# EAGLE design modular pcb1 (EAGLE 9.6.2)
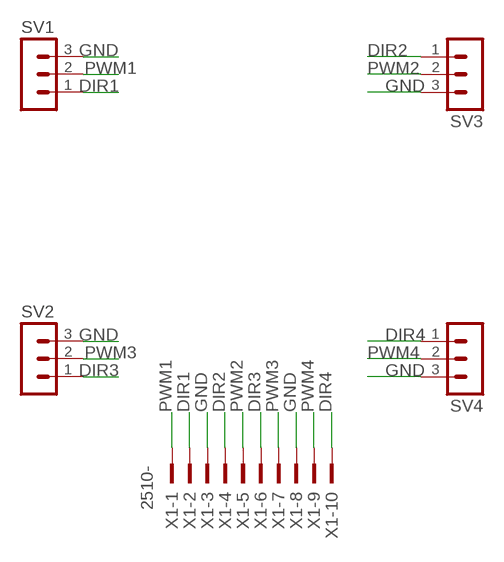
[diagram p0: schematic, sheet 1]

## Parts
SV1  MA03-1  [MA03-1]
SV2  MA03-1  [MA03-1]
SV3  MA03-1  [MA03-1]
SV4  MA03-1  [MA03-1]
X1  2510-  [PAK100/2500-10]

## Nets
DIR1: SV1.1 X1.2
DIR2: SV3.1 X1.4
DIR3: SV2.1 X1.6
DIR4: SV4.1 X1.10
GND: SV1.3 SV2.3 SV3.3 SV4.3 X1.3 X1.8
PWM1: SV1.2 X1.1
PWM2: SV3.2 X1.5
PWM3: SV2.2 X1.7
PWM4: SV4.2 X1.9

## Library data of the parts
SV1-SV4 = con-lstb:MA03-1: PIN HEADER; OC_FARNELL: unknown; OC_NEWARK: unknown
X1 = con-3m:2510-: 3M (TM) Pak 100 4-Wall Header Source: 3M; MF: 3M; MPN: 2510-6002UB; OC_FARNELL: 9838244; OC_NEWARK: 46F4725

## Board
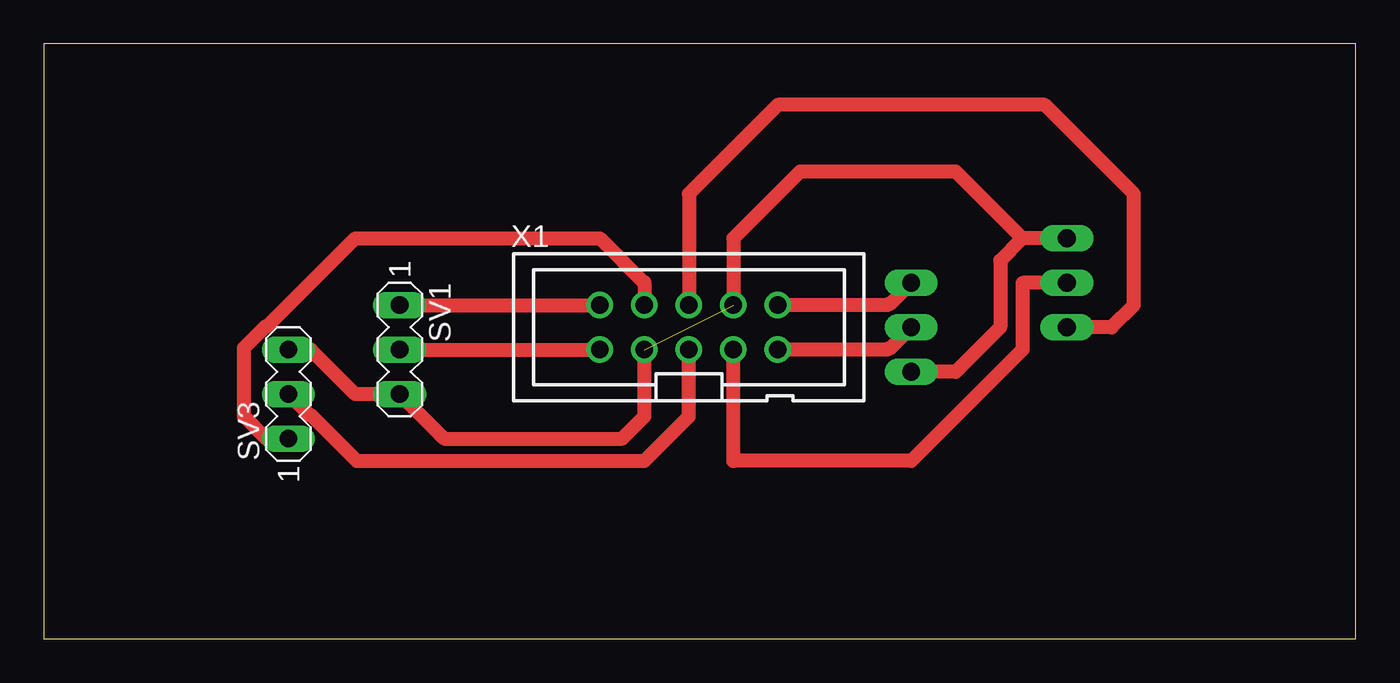
[diagram p1: board, top side]
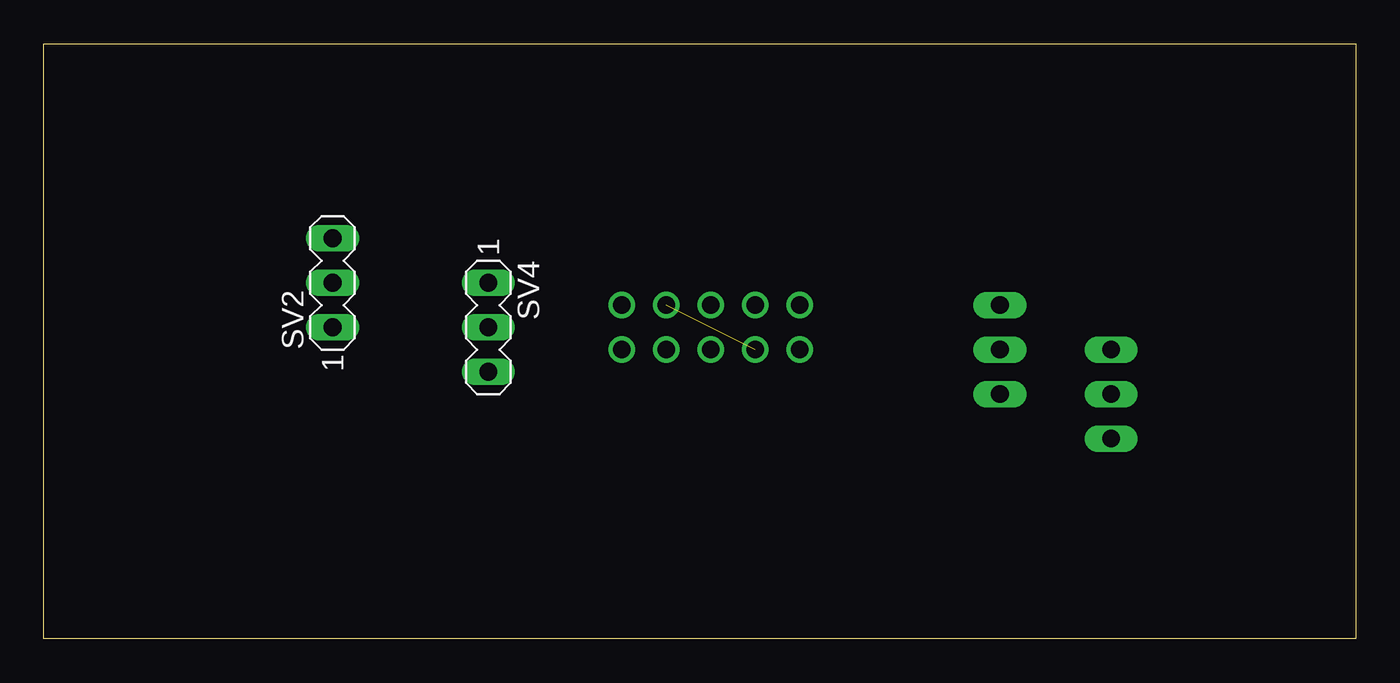
[diagram p2: board, bottom side, seen from below]

Size 74.91 x 33.96 mm. Coordinates in mm from the lower left corner, seen from the top.
Outline: 0,0 74.91,0 74.91,33.96 0,33.96 0,0
Copper layers (1*16): Top 0.035mm / dielectric 1.5mm / Bottom 0.035mm
Design rules "default": minimum track width 6mil, minimum drill 0.35mm, track to track 6mil, track to pad 6mil, pad to pad 6mil, via to via 6mil, smd to smd 6mil, copper to edge 40mil, drill to drill 6mil, minimum pad ring 10mil, minimum via ring 8mil, stop-mask expansion 4mil, vias tented up to drill 0mil, thermal gap 10mil

### Footprints (pad centres in the part's own frame; a part is rotated, then mirrored left to right if it is on the bottom)
MA03-1 = drill 1.016 long: 1 -2.54,0; 2 0,0; 3 2.54,0
PAK100/2500-10 = drill 1 pad 1.422: 1 -5.08,-1.27; 2 -5.08,1.27; 3 -2.54,-1.27; 4 -2.54,1.27; 5 0,-1.27; 6 0,1.27; 7 2.54,-1.27; 8 2.54,1.27; 9 5.08,-1.27; 10 5.08,1.27

### Placement (x,y rotation side)
SV1  20.32,16.51 270 top
SV2  58.42,20.32 90 bottom
SV3  13.97,13.97 90 top
SV4  49.53,17.78 270 bottom
X1  36.83,17.78 0 top

### Tracks (layer width: path | path; a pad name or v marks a point on that pad's centre or on a via)
DIR1
  Top 0.813: SV1.1 X1.2
DIR2
  Top 0.813: 34.25,20.36 31.75,22.86 17.78,22.86 12.75,17.83 12.66,17.83 11.43,16.6 11.43,12.7 12.7,11.43 SV3.1 | 34.25,20.36 34.29,20.36 | 34.25,20.36 34.29,20.32 X1.4
DIR3
  Top 0.813: SV2.1 60.96,17.78 62.23,19.05 62.23,25.4 57.15,30.48 41.91,30.48 36.83,25.4 X1.6
DIR4
  Top 0.813: SV4.1 48.31,19.1 48.22,19.1 48.17,19.05 X1.10
GND  (1 unrouted)
  Top 0.813: SV2.3 55.88,22.86 | 55.88,22.86 54.61,21.59 54.61,17.78 52.07,15.24 SV4.3 | 55.88,22.86 52.07,26.67 43.18,26.67 39.37,22.86 X1.8 | SV3.3 15.24,16.51 17.78,13.97 SV1.3 22.86,11.43 33.02,11.43 34.29,12.7 X1.3
PWM1
  Top 0.813: SV1.2 X1.1
PWM2
  Top 0.813: SV3.2 15.19,12.75 15.28,12.75 17.87,10.16 34.29,10.16 36.83,12.7 X1.5
PWM3
  Top 0.813: SV2.2 55.88,20.32 55.88,16.51 49.53,10.16 39.37,10.16 X1.7
PWM4
  Top 0.813: SV4.2 48.31,16.56 48.22,16.56 48.17,16.51 X1.9